# Altium schematic sheet Main Schematics.SchDoc (part 1 of 3)
size A3; SheetNumber: 1; SheetTotal: 1
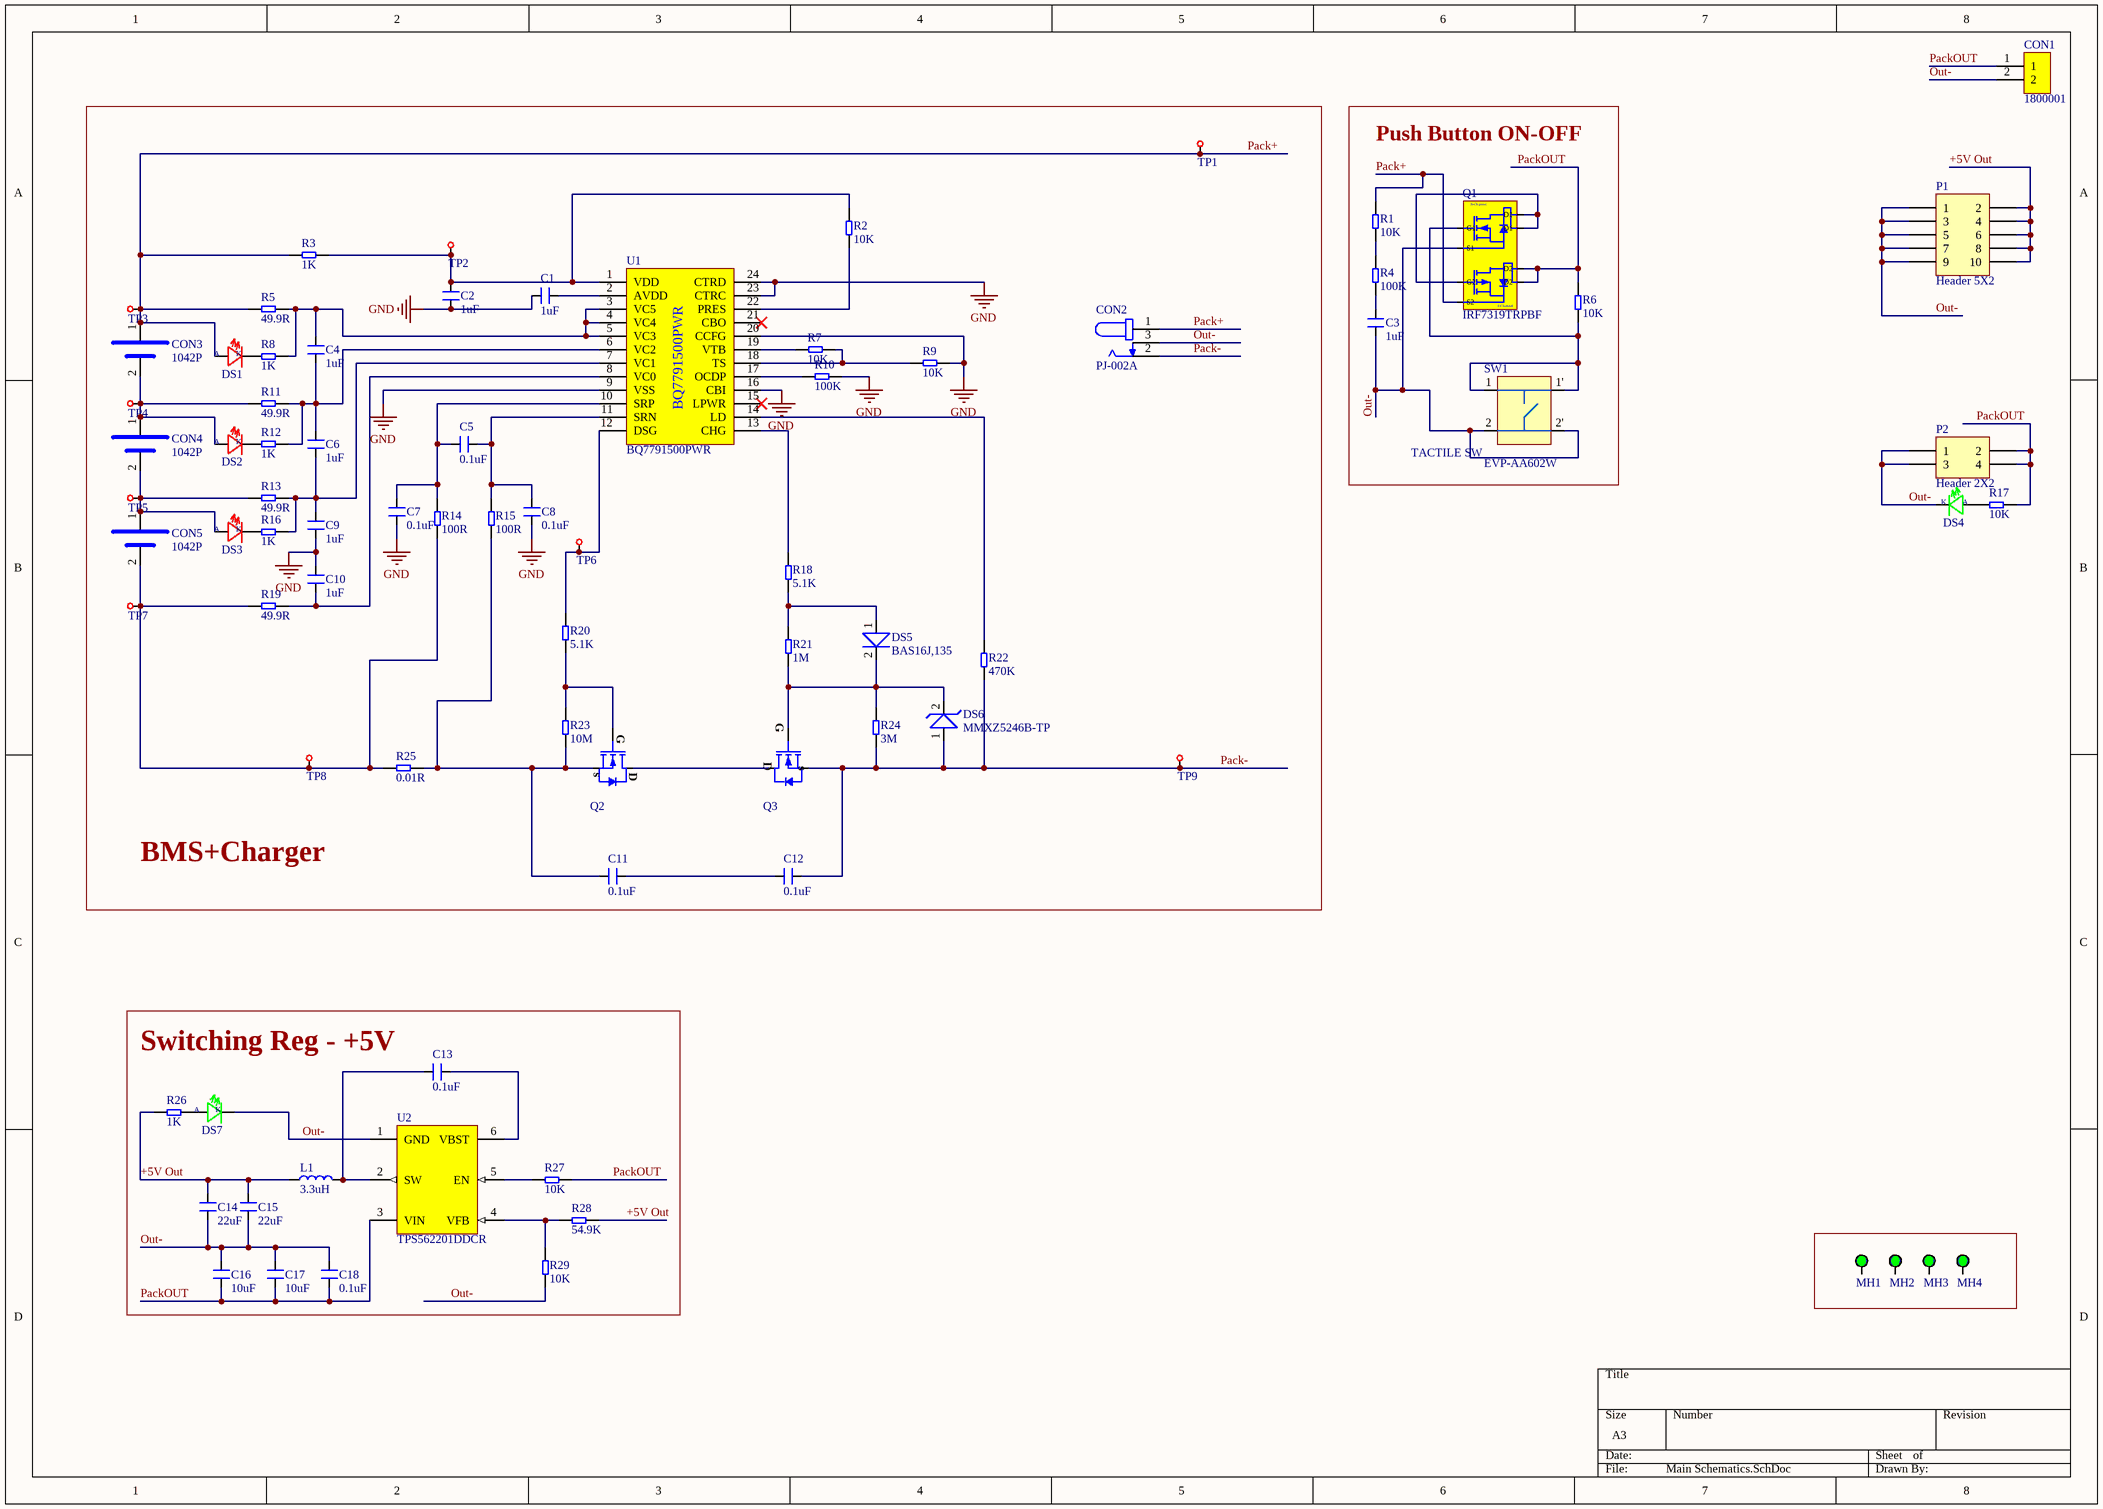
[diagram p0: Main Schematics.SchDoc]

## Parts
C1  1uF  [CAP_0805]
C2  1uF  [CAP_0805]
C3  1uF  [CAP_0805]
C4  1uF  [CAP_0805]
C5  0.1uF  [CAP_0805]
C6  1uF  [CAP_0805]
C7  0.1uF  [CAP_0805]
C8  0.1uF  [CAP_0805]
C9  1uF  [CAP_0805]
C10  1uF  [CAP_0805]
C11  0.1uF  [CAP_0805]
C12  0.1uF  [CAP_0805]
C13  0.1uF  [CAP_0805]
C14  22uF  [CAP_0805]
C15  22uF  [CAP_0805]
C16  10uF  [CAP_1206]
C17  10uF  [CAP_1206]
C18  0.1uF  [CAP_0805]
CON1  1800001  [CON_ED_2POS_TH_2.54mm]
CON2  PJ-002A  [CUI_PJ-002A]
CON3  1042P  [1042P]
CON4  1042P  [1042P]
CON5  1042P  [1042P]
DS1  HSMS-C190  [LED_0603]  (value not drawn)
DS2  HSMS-C190  [LED_0603]  (value not drawn)
DS3  HSMS-C190  [LED_0603]  (value not drawn)
DS4  HSMG-C190  [LED_0603]  (value not drawn)
DS5  BAS16J,135  [SOD323F]
DS6  MMXZ5246B-TP  [SOD323 Zener]
DS7  HSMG-C190  [LED_0603]  (value not drawn)
L1  3.3uH  [Non-Standard_IND 744311330]
MH1  MH_3mm  [MH_3mm]  (value not drawn)  (no BOM)
MH2  MH_3mm  [MH_3mm]  (value not drawn)  (no BOM)
MH3  MH_3mm  [MH_3mm]  (value not drawn)  (no BOM)
MH4  MH_3mm  [MH_3mm]  (value not drawn)  (no BOM)
P1  Header 5X2  [HDR2X5]
P2  Header 2X2  [HDR2X2]
Q1  IRF7319TRPBF  [SO-8_IRF7319]
Q2  CSD18534Q5A  [Q5A]  (value not drawn)
Q3  CSD18534Q5A  [Q5A]  (value not drawn)
R1  10K  [RES_0805]
R2  10K  [RES_0805]
R3  1K  [RES_0805]
R4  100K  [RES_0805]
R5  49.9R  [RES_1206]
R6  10K  [RES_0805]
R7  10K  [RES_0805]
R8  1K  [RES_0805]
R9  10K  [RES_0805]
R10  100K  [RES_0805]
R11  49.9R  [RES_1206]
R12  1K  [RES_0805]
R13  49.9R  [RES_1206]
R14  100R  [RES_0805]
R15  100R  [RES_0805]
R16  1K  [RES_0805]
R17  10K  [RES_0805]
R18  5.1K  [RES_0805]
R19  49.9R  [RES_1206]
R20  5.1K  [RES_0805]
R21  1M  [RES_0805]
R22  470K  [RES_0805]
R23  10M  [RES_0805]
R24  3M  [RES_0805]
R25  0.01R  [RES_2010]
R26  1K  [RES_0805]
R27  10K  [RES_0805]
R28  54.9K  [RES_0805]
R29  10K  [RES_0805]
SW1  EVP-AA602W  [SW_Tactile_SPDT EVP-AA602W]
TP1  Test Point SMD Round 1.27mm  [Test Point Round 1.27mm]  (value not drawn)  (net tie, no BOM)
TP2  Test Point SMD Round 1.27mm  [Test Point Round 1.27mm]  (value not drawn)  (net tie, no BOM)
TP3  Test Point SMD Round 1.27mm  [Test Point Round 1.27mm]  (value not drawn)  (net tie, no BOM)
TP4  Test Point SMD Round 1.27mm  [Test Point Round 1.27mm]  (value not drawn)  (net tie, no BOM)
TP5  Test Point SMD Round 1.27mm  [Test Point Round 1.27mm]  (value not drawn)  (net tie, no BOM)
TP6  Test Point SMD Round 1.27mm  [Test Point Round 1.27mm]  (value not drawn)  (net tie, no BOM)
TP7  Test Point SMD Round 1.27mm  [Test Point Round 1.27mm]  (value not drawn)  (net tie, no BOM)
TP8  Test Point SMD Round 1.27mm  [Test Point Round 1.27mm]  (value not drawn)  (net tie, no BOM)
TP9  Test Point SMD Round 1.27mm  [Test Point Round 1.27mm]  (value not drawn)  (net tie, no BOM)
U1  BQ7791500PWR  [TSSOP24]
U2  TPS562201DDCR  [SOT-23-6 Thin]

## Blocks framed on the sheet
BMS+Charger: C1 C2 C4-C12 CON2-CON5 DS1-DS3 DS5 DS6 Q2 Q3 R2 R3 R5 R7-R16 R18-R25 TP1-TP9 U1
Push Button ON-OFF: C3 Q1 R1 R4 R6 SW1
Switching Reg - +5V: C13-C18 DS7 L1 R26-R29 U2

## Nets
GND: C1.1 C2.2 C7.1 C8.1 C9.1 C10.1 R9.2 R10.2 U1.9(VSS) U1.16(CBI) U1.20(CCFG) U1.23(CTRC) U1.24(CTRD)
+5V Out: C14.2 C15.2 L1.1 P1.2 P1.4 P1.6 P1.8 P1.10 R26.1 R28.2
Out-: C3.1 C14.1 C15.1 C16.2 C17.2 C18.2 CON1.2 CON2.3 DS4.2 DS7.2 P1.1 P1.3 P1.5 P1.7 P1.9 P2.1 P2.3 Q1.1(S1) R29.1 SW1.2 SW1.2' U2.1(GND)
Pack+: CON2.1 CON3.1 DS1.1 Q1.3(S2) R1.2 R3.1 R5.1 TP1.1 TP3.1
Pack-: C12.1 CON2.2 DS6.1 Q3.1,2,3(S) R22.1 R24.1 TP9.1
PackOUT: C16.1 C17.1 C18.1 CON1.1 P2.2 P2.4 Q1.5(D2) Q1.6(D2) R6.2 R17.2 R27.1 U2.3(VIN)
NetC1_2: C1.2 U1.2(AVDD)
NetC2_1: C2.1 R2.2 R3.2 TP2.1 U1.1(VDD)
NetC3_2: C3.2 R4.1
NetC4_1: C4.1 C6.2 R11.2 R12.2 U1.6(VC2)
NetC4_2: C4.2 R5.2 R8.2 U1.3(VC5) U1.4(VC4) U1.5(VC3)
NetC5_1: C5.1 C8.2 R15.2 U1.11(SRN)
NetC5_2: C5.2 C7.2 R14.2 U1.10(SRP)
NetC6_1: C6.1 C9.2 R13.2 R16.2 U1.7(VC1)
NetC10_2: C10.2 R19.2 U1.8(VC0)
NetC11_1: C11.1 C12.2
NetC11_2: C11.2 Q2.1,2,3(S) R15.1 R23.1 R25.2
NetC13_1: C13.1 L1.2 U2.2(SW)
NetC13_2: C13.2 U2.6(VBST)
NetCON3_2: CON3.2 CON4.1 DS2.1 R11.1 TP4.1
NetCON4_2: CON4.2 CON5.1 DS3.1 R13.1 TP5.1
NetCON5_2: CON5.2 R14.1 R19.1 R25.1 TP7.1 TP8.1
NetDS4_1: DS4.1 R17.1
NetDS5_1: DS5.1 R18.1 R21.2
NetDS5_2: DS5.2 DS6.2 Q3.4(G) R21.1 R24.2
NetDS7_1: DS7.1 R26.2
NetQ1_2: Q1.2(G1) R6.1 SW1.1 SW1.1'
NetQ1_4: Q1.4(G2) Q1.7(D1) Q1.8(D1)
NetQ2_4: Q2.4(G) R20.1 R23.2
NetQ2_5,6,7,8: Q2.5,6,7,8(D) Q3.5,6,7,8(D)
NetR1_1: R1.1 R4.2
NetR2_1: R2.1 U1.22(PRES)
NetR7_1: R7.1 U1.19(VTB)
NetR7_2: R7.2 R9.1 U1.18(TS)
NetR10_1: R10.1 U1.17(OCDP)
NetR18_2: R18.2 U1.13(CHG)
NetR20_2: R20.2 TP6.1 U1.12(DSG)
NetR22_2: R22.2 U1.14(LD)
NetR27_2: R27.2 U2.5(EN)
NetR28_1: R28.1 R29.2 U2.4(VFB)

Not connected (* = marked no-connect by the designer): DS1 2; DS2 2; DS3 2; MH1 1; MH2 1; MH3 1; MH4 1; R8 1; R12 1; R16 1; U1 15(LPWR)* 21(CBO)*